# Altium project J-Link ARM OB.PrjPcb
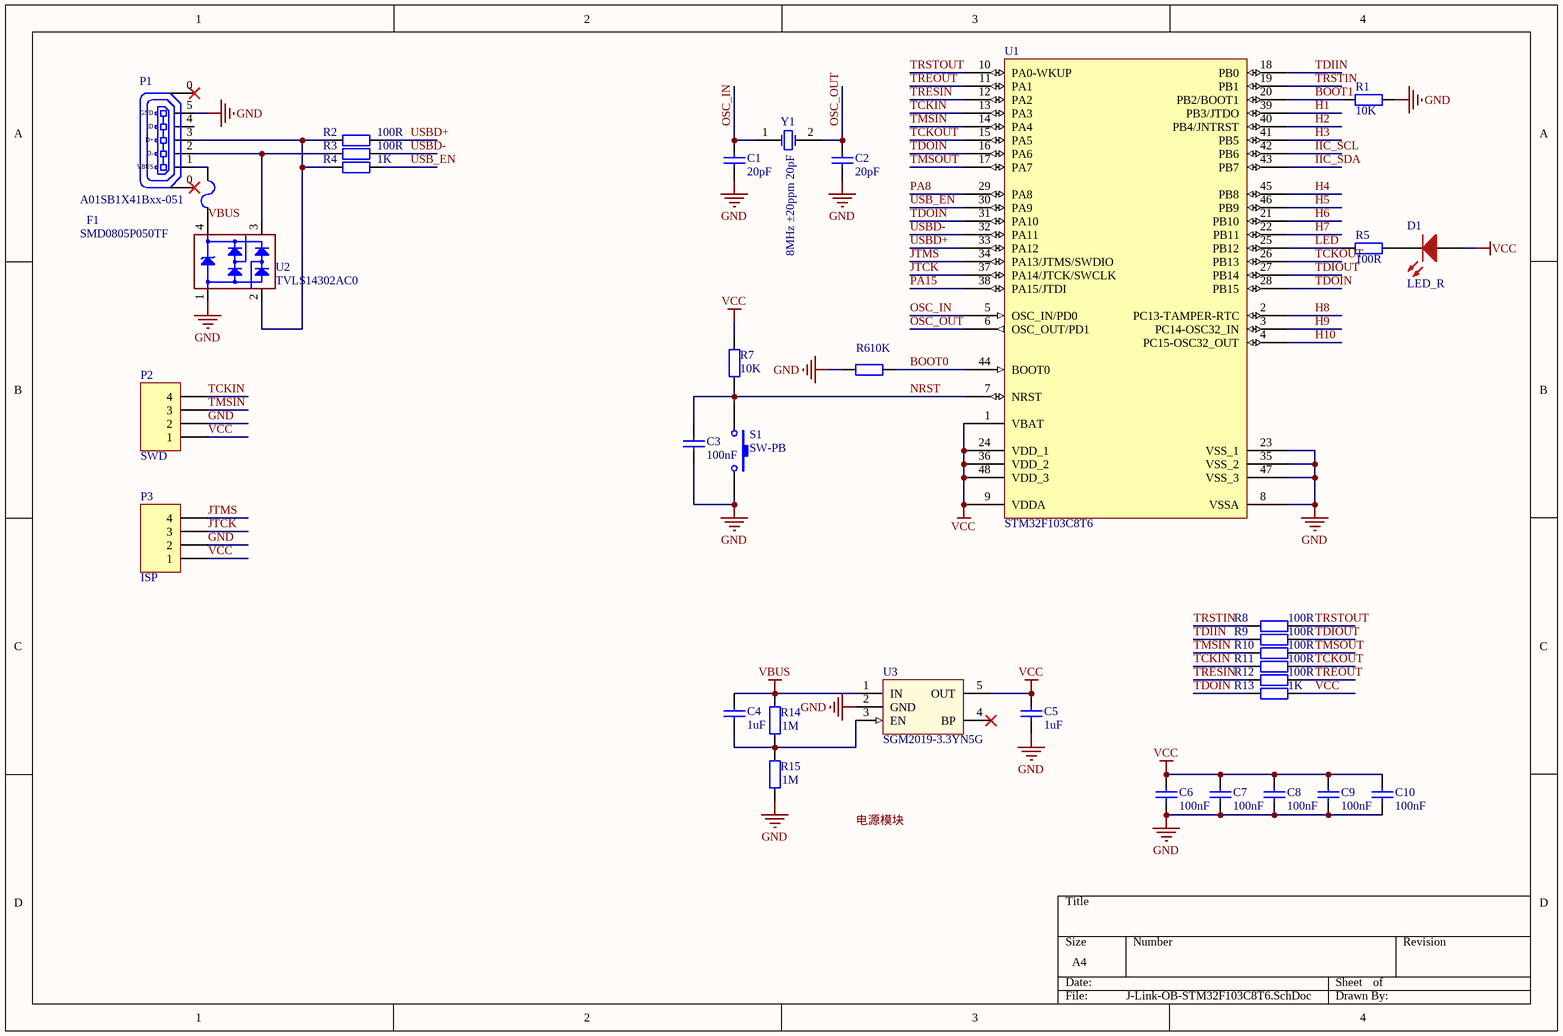
[diagram p0: J-Link-OB-STM32F103C8T6.SchDoc]
1 sheet, 35 parts. Net scope: global (net labels, ports and power ports of the same name join across sheets).
Board file: J-Link ARM OB.PcbDoc

## Sheet J-Link-OB-STM32F103C8T6.SchDoc
size A4

### Parts
C1  20pF  [CAP0603]
C2  20pF  [CAP0603]
C3  100nF  [CAP0603]
C4  1uF  [CAP0603]
C5  1uF  [CAP0603]
C6  100nF  [CAP0603]
C7  100nF  [CAP0603]
C8  100nF  [CAP0603]
C9  100nF  [CAP0603]
C10  100nF  [CAP0603]
D1  LED_R  [19-21]
F1  SMD0805P050TF  [SMD0805P050TF]
P1  A01SB1X41Bxx-051  [A01SB1X41Bxx-051]
P2  SWD  [HDR1X4H]
P3  ISP  [HDR1X4]
R1  10K  [RES0603]
R2  100R  [RES0603]
R3  100R  [RES0603]
R4  1K  [RES0603]
R5  100R  [RES0603]
R6  10K  [RES0603]
R7  10K  [RES0603]
R8  100R  [RES0603]
R9  100R  [RES0603]
R10  100R  [RES0603]
R11  100R  [RES0603]
R12  100R  [RES0603]
R13  1K  [RES0603]
R14  1M  [RES0603]
R15  1M  [RES0603]
S1  SW-PB  [SW-SKRK-SKRKAEE010]
U1  STM32F103C8T6  [LQFP48_N]
U2  TVLS14302AC0  [SOT-143-4L]
U3  SGM2019-3.3YN5G  [SOT23-5_L]
Y1  8MHz ±20ppm 20pF  [SMD-5032_2P]

### Nets
GND: C1.1 C2.1 C3.1 C5.1 C6.1 C7.1 C8.1 C9.1 C10.1 P1.5(GND) P2.2 P3.2 R1.2 R6.1 R15.1 S1.2 U1.8(VSSA) U1.23(VSS_1) U1.35(VSS_2) U1.47(VSS_3) U2.1(GND) U3.2(GND)
VBUS: C4.2 F1.1 R14.2 U2.4(VDD) U3.1(IN)
VCC: C5.2 C6.2 C7.2 C8.2 C9.2 C10.2 D1.1(A) P2.1 P3.1 R7.2 R13.1 U1.1(VBAT) U1.9(VDDA) U1.24(VDD_1) U1.36(VDD_2) U1.48(VDD_3) U3.5(OUT)
BOOT0: R6.2 U1.44(BOOT0)
BOOT1: R1.1 U1.20(PB2/BOOT1)
H1: U1.39(PB3/JTDO)
H2: U1.40(PB4/JNTRST)
H3: U1.41(PB5)
H4: U1.45(PB8)
H5: U1.46(PB9)
H6: U1.21(PB10)
H7: U1.22(PB11)
H8: U1.2(PC13-TAMPER-RTC)
H9: U1.3(PC14-OSC32_IN)
H10: U1.4(PC15-OSC32_OUT)
IIC_SCL: U1.42(PB6)
IIC_SDA: U1.43(PB7)
JTCK: P3.3 U1.37(PA14/JTCK/SWCLK)
JTMS: P3.4 U1.34(PA13/JTMS/SWDIO)
LED: R5.1 U1.25(PB12)
NRST: C3.2 R7.1 S1.1 U1.7(NRST)
OSC_IN: C1.2 U1.5(OSC_IN/PD0) Y1.1(OSC1)
OSC_OUT: C2.2 U1.6(OSC_OUT/PD1) Y1.2(OSC2)
PA8: U1.29(PA8)
PA15: U1.38(PA15/JTDI)
TCKIN: P2.4 R11.2 U1.13(PA3)
TCKOUT: R11.1 U1.15(PA5) U1.26(PB13)
TDIIN: R9.2 U1.18(PB0)
TDIOUT: R9.1 U1.27(PB14)
TDOIN: R13.2 U1.16(PA6) U1.28(PB15) U1.31(PA10)
TMSIN: P2.3 R10.2 U1.14(PA4)
TMSOUT: R10.1 U1.17(PA7)
TREOUT: R12.1 U1.11(PA1)
TRESIN: R12.2 U1.12(PA2)
TRSTIN: R8.2 U1.19(PB1)
TRSTOUT: R8.1 U1.10(PA0-WKUP)
USB_EN: R4.1 U1.30(PA9)
USBD+: R2.1 U1.33(PA12)
USBD-: R3.1 U1.32(PA11)
NetC4_1: C4.1 R14.1 R15.2 U3.3(EN)
NetD1_2: D1.2(K) R5.2
NetF1_2: F1.2 P1.1(VBUS)
NetP1_2: P1.2(D-) R3.2 U2.3(I/O2)
NetP1_3: P1.3(D+) R2.2 R4.2 U2.2(I/O1)

Not connected (* = marked no-connect by the designer): P1 0(PAD)* 4(ID); U3 4(BP)*

### Notes on the sheet
- 电源模块

### Library data of the parts
C1 C2 = Cap 20pF/±5%/50V/0603: 0603, C0G, 20pF, ±5%, 50V, CL; PartNumber: CL10C200JB8NNNC; Manufacturer: Samsung; Packing: Tape and Reel; CaseSize(inch): 0603; OperationTemperatureRange: -55~+125 °C; ComponentLink2URL: http://www.samsungsem.com/global/support/library/product-catalog/__icsFiles/afieldfile/2014/11/13/MLCC.pdf; ComponentLink1Description: Manufacturer URL; ComponentLink1URL: http://www.samsungsem.com/; ComponentLink2Description: Datasheet; ComponentLink3Description: Package Specification; ComponentLink3URL: null; Mounting Technology: Surface Mount; PackageDescription: 2-Pin , Body 1.6 x 0.8 x 0.8 mm; PackageVersion: 25-Dec-2014; RoHS: TRUE; Series: CL; Voltage: 50 V; CapacitanceChange: ±5%; Dielectric: C0G; Value: 20pF
C3 C6-C10 = Cap 100nF/±10%/50V/0603: 0603, X7R, 100nF, ±10%, 50V, CL; PartNumber: CL10B104KB8NNNC; Manufacturer: Samsung; Packing: Tape and Reel; CaseSize(inch): 0603; OperationTemperatureRange: -55~+125 °C; ComponentLink2URL: http://www.samsungsem.com/global/support/library/product-catalog/__icsFiles/afieldfile/2014/11/13/MLCC.pdf; ComponentLink1Description: Manufacturer URL; ComponentLink1URL: http://www.samsungsem.com/; ComponentLink2Description: Datasheet; ComponentLink3Description: Package Specification; ComponentLink3URL: null; Mounting Technology: Surface Mount; PackageDescription: 2-Pin , Body 1.6 x 0.8 x 0.8 mm; PackageVersion: 25-Dec-2014; RoHS: TRUE; Series: CL; Voltage: 50 V; CapacitanceChange: ±10%; Dielectric: X7R; Supplier 1: Digi-Key; Supplier Part Number 1: 1276-1000-2-ND; Value: 100nF
C4 C5 = Cap 1uF/±10%/16V/0603: 0603, X5R, 1uF, ±10%, 16V, CL; PartNumber: CL10A105KO8NNNC; Manufacturer: Samsung; Packing: Tape and Reel; CaseSize(inch): 0603; OperationTemperatureRange: -55~+85 °C; ComponentLink2URL: http://www.samsungsem.com/global/support/library/product-catalog/__icsFiles/afieldfile/2014/11/13/MLCC.pdf; ComponentLink1Description: Manufacturer URL; ComponentLink1URL: http://www.samsungsem.com/; ComponentLink2Description: Datasheet; ComponentLink3Description: Package Specification; ComponentLink3URL: null; Mounting Technology: Surface Mount; PackageDescription: 2-Pin , Body 1.6 x 0.8 x 0.8 mm; PackageVersion: 25-Dec-2014; RoHS: TRUE; Series: CL; Voltage: 16 V; CapacitanceChange: ±10%; Dielectric: X5R; Supplier 1: Digi-Key; Supplier Part Number 1: 1276-1034-2-ND; Value: 1uF
D1 = LED_19-21/R7C-AN2Q1B/3T: SMD0603 LED, 2-Pin 19-21, Pb-Free, Tape and Reel; Manufacturer: Everlight; Configuration: Single; Reverse Voltage Vr (V): 5; Forward Current If (mA): 25; Color: DeepRed; fD(nm): 631; DatasheetVersion: Rev.4, 11/2016; PackageVersion: Rev.*, **/****; PackageReference: 22-23C; PackageDescription: 2-Pin 19-21, Body 1.6 x 0.8 mm; Packing: Tape and Reel; RoHS: TRUE; Mounting Technology: Surface Mount; PartNumber: 19-21/R7C-AN2Q1B/3T; ComponentLink1Description: Manufacturer URL; ComponentLink1URL: http://www.everlight.com; ComponentLink2Description: Datasheet; ComponentLink2URL: http://www.everlight.com/file/ProductFile/DSE-0002640-19-21-R7C-AN2Q1B-3T-V4.pdf; ComponentLink3Description: Package Specification; ComponentLink3URL: null; Value: LED_R; Storage Temperature (°C): -40~+90; Operating Temperature (°C): -40~+85
F1 = SMD0805P050TF: Over Current Protection, Resettable Fuses-PPTC, SMD0805 Series, I(hold) 0.05~1.25A; Manufacturer: Shenzhen Ruilongyuan; Accuracy(%): NULL; Eco-Plan: Green (RoHS & no Sb/Br); V(Max)(V): 6; Pd(Typ)(W): 0.5; Type: PPTC; I(Max)(A): 100; DatasheetVersion: NULL; PackageVersion: NULL; PackageReference: 0805; PackageDescription: 0805, Body 2.2 x 1.5 mm; SubFamily: SMD0805 Series; Mounting Technology: Surface Mount; Code_JEDEC: NULL; PartNumber: SMD0805P050TF; ComponentLink1Description: Manufacturer URL; ComponentLink1URL: http://www.ruilon.com; ComponentLink2Description: Datasheet; ComponentLink2URL: http://www.ruilon.com/files/upload/pdfs/0805.pdf; ComponentLink3Description: Package Specification; ComponentLink3URL: NULL; Value: SMD0805P050TF; AmbientTemperature(°C): 25; HoldCurrent (A): 0.5
P1 = C40956/5P: Micro USB, 7-Pin SMT-Micro-B, no Flange, Pitch 10.25mm; Manufacturer: XinNanTian; Configuration: Single; Packing: Tape and Reel; Marking: null; DatasheetVersion: Rev.*, 05/2012; PackageVersion: Rev. *,05 /2012; PackageReference: SMT-Micro-B-Mid-Mount; PackageDescription: 7-Pin SMT-Micro-B, Body 10.5 x 6.25 mm; RoHS: TRUE; Mounting Technology: Surface Mount; PartNumber: A01SB1X41Bxx-051; ComponentLink1Description: Manufacturer URL; ComponentLink1URL: http://www.sznantian.com; ComponentLink2Description: Datasheet; ComponentLink2URL: http://www.sznantian.com/sznantian/UploadFiles/201598202853930.pdf; ComponentLink3Description: Package Specification; ComponentLink3URL: null; Value: A01SB1X41Bxx-051; OperatingTemperature: -30~+80 °C; StorageTemperature: NULL °C
P2 = Header 4H: Header, 4-Pin, Right Angle; LatestRevisionDate: 17-Jul-2002; LatestRevisionNote: Re-released for DXP Platform.; Publisher: Altium Limited
P3 = Header 4: Header, 4-Pin; LatestRevisionDate: 17-Jul-2002; LatestRevisionNote: Re-released for DXP Platform.; Publisher: Altium Limited
R1 R6 R7 = Res 10KΩ/±1%/0603: 10KΩ, ±1%, 0603, RC; PartNumber: RC0603FR-0710KL; Manufacturer: Yageo; Packing: Tape and Reel; Power: 1/10 W; CaseSize(inch): 0603; TypicalTCR: 100 ppm/°C; Voltay: 50 V; ComponentLink2URL: http://www.yageo.com/NewPortal/yageodocoutput?fileName=/pdf/R-Chip/PYu-RC_Group_51_RoHS_L_0.pdf; ComponentLink1Description: Manufacturer URL; ComponentLink1URL: http://www.yageo.com/; ComponentLink2Description: Datasheet; ComponentLink3Description: Package Specification; ComponentLink3URL: null; Mounting Technology: Surface Mount; PackageDescription: 2-Pin , Body 1.6 x 0.8 mm; PackageVersion: 25-Dec-2014; RoHS: TRUE; Series: RC; Value: 10K
R2 R3 R8-R12 = Res 100Ω/±1%/0603: 100Ω, ±1%, 0603, RC; PartNumber: RC0603FR-07100RL; Manufacturer: Yageo; Packing: Tape and Reel; Power: 1/10 W; CaseSize(inch): 0603; TypicalTCR: 100 ppm/°C; Voltay: 50 V; ComponentLink2URL: http://www.yageo.com/NewPortal/yageodocoutput?fileName=/pdf/R-Chip/PYu-RC_Group_51_RoHS_L_0.pdf; ComponentLink1Description: Manufacturer URL; ComponentLink1URL: http://www.yageo.com/; ComponentLink2Description: Datasheet; ComponentLink3Description: Package Specification; ComponentLink3URL: null; Mounting Technology: Surface Mount; PackageDescription: 2-Pin , Body 1.6 x 0.8 mm; PackageVersion: 25-Dec-2014; RoHS: TRUE; Series: RC; Value: 100R; Type: General Purpose Chip Resistor
R4 R13 = Res 100Ω/±1%/0603: 100Ω, ±1%, 0603, RC; PartNumber: RC0603FR-07100RL; Manufacturer: Yageo; Packing: Tape and Reel; Power: 1/10 W; CaseSize(inch): 0603; TypicalTCR: 100 ppm/°C; Voltay: 50 V; Value: 100R; ComponentLink2URL: http://www.yageo.com/NewPortal/yageodocoutput?fileName=/pdf/R-Chip/PYu-RC_Group_51_RoHS_L_0.pdf; ComponentLink1Description: Manufacturer URL; ComponentLink1URL: http://www.yageo.com/; ComponentLink2Description: Datasheet; ComponentLink3Description: Package Specification; ComponentLink3URL: null; Mounting Technology: Surface Mount; PackageDescription: 2-Pin , Body 1.6 x 0.8 mm; PackageVersion: 25-Dec-2014; RoHS: TRUE; Series: RC; Type: General Purpose Chip Resistor
R5 = Res 100Ω/±5%/0603: 100Ω, ±5%, 0603, RC; PartNumber: RC0603JR-07100RL; Manufacturer: Yageo; Packing: Tape and Reel; Power: 1/10 W; CaseSize(inch): 0603; TypicalTCR: 100 ppm/°C; Voltay: 50 V; ComponentLink2URL: http://www.yageo.com/NewPortal/yageodocoutput?fileName=/pdf/R-Chip/PYu-RC_Group_51_RoHS_L_0.pdf; ComponentLink1Description: Manufacturer URL; ComponentLink1URL: http://www.yageo.com/; ComponentLink2Description: Datasheet; ComponentLink3Description: Package Specification; ComponentLink3URL: null; Mounting Technology: Surface Mount; PackageDescription: 2-Pin , Body 1.6 x 0.8 mm; PackageVersion: 25-Dec-2014; RoHS: TRUE; Series: RC; Value: 100R
R14 R15 = Res 1MΩ/±5%/0603: 1MΩ, ±5%, 0603, RC; PartNumber: RC0603JR-071ML; Manufacturer: Yageo; Packing: Tape and Reel; Power: 1/10 W; CaseSize(inch): 0603; TypicalTCR: 100 ppm/°C; Voltay: 50 V; ComponentLink2URL: http://www.yageo.com/NewPortal/yageodocoutput?fileName=/pdf/R-Chip/PYu-RC_Group_51_RoHS_L_0.pdf; ComponentLink1Description: Manufacturer URL; ComponentLink1URL: http://www.yageo.com/; ComponentLink2Description: Datasheet; ComponentLink3Description: Package Specification; ComponentLink3URL: null; Mounting Technology: Surface Mount; PackageDescription: 2-Pin , Body 1.6 x 0.8 mm; PackageVersion: 25-Dec-2014; RoHS: TRUE; Series: RC; Value: 1M
S1 = SW-PB: Switch; Published: 24-Mar-1999; LatestRevisionDate: 17-Jul-2002; LatestRevisionNote: Re-released for DXP Platform.; PackageReference: SPST-2; Publisher: Altium Limited; PackageDescription: Switch; 2 Leads
U1 = STM32F103C8T6: STM32 ARM-based 32-bit MCU with 64 Kbytes Flash, 48-pin LQFP, Industrial Temperature; Published: 30-May-2008; DatasheetVersion: rev6, Mar-2008; PackageVersion: Mar-2008; PackageReference: LQFP48; Publisher: Altium Limited; PackageDescription: 48-Pin Low-Profile Quad Flat Pack, 7 x 7 mm Body, 0.5 mm Pitch (LQFP48); ComponentLink1Description: Manufacturer Link; ComponentLink1URL: www.st.com/stm32; ComponentLink2Description: Datasheet; ComponentLink2URL: http://www.st.com/stonline/products/literature/ds/13587.pdf
U2 = TVS_TVLS14302AC0: Multi-Line TVS Array, 4-Pin SOT-143-4L, Pb-Free, Tape and Reel; Manufacturer: INPAQ; Configuration: Three; Peak Pulse Power (W): 150; Marking: C06; Vrwm Max (V): 5; Vbr Min (V): 6; DatasheetVersion: Rev.A9, **/****; PackageVersion: Rev. *, null; PackageReference: SOT-143-4L; PackageDescription: 4-Pin SOT-143-4L, Body 3.0 x 2.55 mm; Packing: Tape and Reel; RoHS: TRUE; Mounting Technology: Surface Mount; PartNumber: TVLS14302AC0; ComponentLink1Description: Manufacturer URL; ComponentLink1URL: http://www.inpaq.com.tw; ComponentLink2Description: Datasheet; ComponentLink2URL: http://www.inpaq.com.tw/Specification/TVS/INPAQ%20Transient%20Voltage%20Suppressor%20TVL%20S143%2002%20AC0%20Specification_A9%20[SOT143-4L].pdf; ComponentLink3Description: Package Specification; ComponentLink3URL: null; Value: TVLS14302AC0; Operating Temperature (°C): -55-125; Storage Temperature (°C): -55-150
U3 = SGM2019-3.3YN5G: Single Output LDO, 300 mA, 3.3V Fixed Out, 2.5 to 5.5 V Input, 5-Pin SOT-23; Manufacturer: SG Micro Corp; PartNumber: SGM2019-3.3YN5G/TR; Accuracy: 2.5%; DynamicVoltageScaling: TRUE; EcoPlan: Green (RoHS & no Sb/Br); IoutMax: 300 mA; IqTyp: 100 μA; SubFamily: Single Channel LDO; VdoTyp: 270 mV; VinMax: 5.5 V; VinMin: 2.5 V; CodeJedec: MO-178-C; PackageMarking: YJ33; DatasheetVersion: Rev.C; PackageVersion: NULL; PackageReference: SOT23-5; PackageDescription: 5-Pin Plastic Small Outline, Body 2.9 x 2.7 mm, 0.95 mm Pitch; VoutTyp: 3.3 V; MountingTechnology: Surface Mount; ComponentLink1Description: Manufacturer URL; ComponentLink1URL: http://www.sg-micro.com/; ComponentLink2Description: Datasheet; ComponentLink2URL: http://www.sg-micro.com/pdf/SGM2019.pdf; ComponentLink3Description: Package Specification; ComponentLink3URL: NULL; Value: SGM2019-3.3YN5G; Type: Linear Regulator (LDO); OperatingTemperature: -40~+85 ℃; StorageTemperature: -65~+150 ℃
Y1 = SMD-5032_2P 8MHz 20ppm 20pF: 贴片晶振; ComponentLink1URL: http://www.szlcsc.com/product/details_117214.html; Package: SMD-5032_2P; Supplier: LC; SuppliersPartNumber: C115962